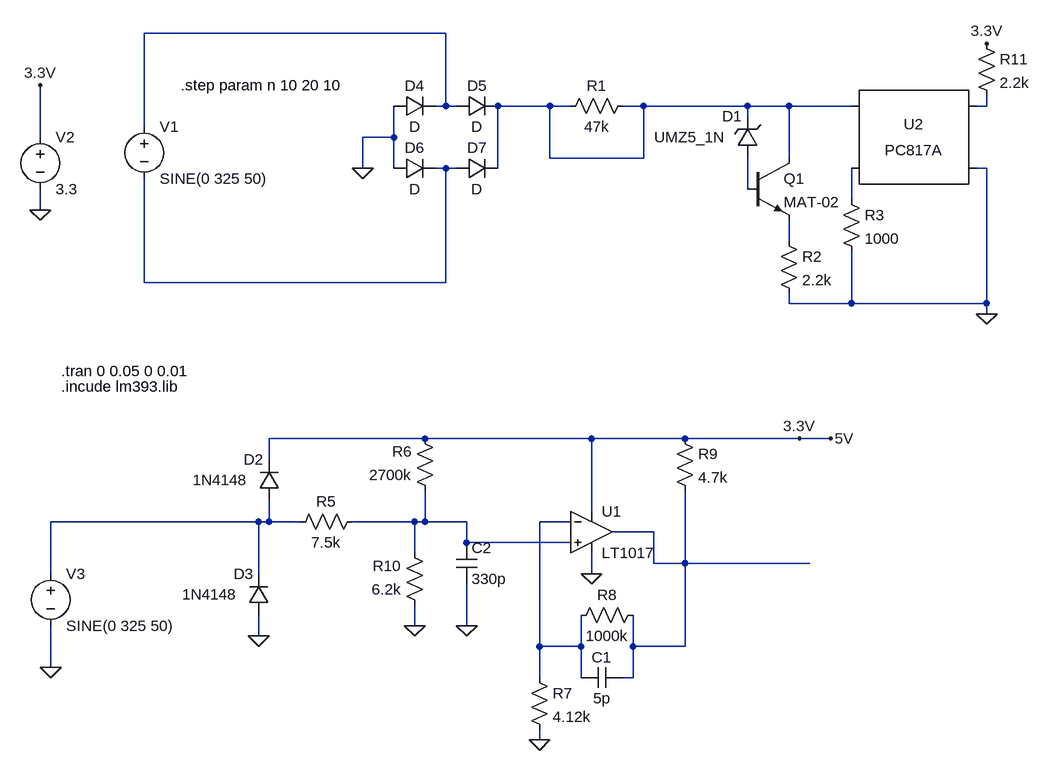
[diagram p0: schematic ZeroComp.asc]
ZeroComp.asc, the LTspice schematic file:
Version 4
SHEET 1 1336 916
WIRE 192 -192 -272 -192
WIRE 192 -80 192 -192
WIRE 192 -80 176 -80
WIRE 208 -80 192 -80
WIRE 352 -80 272 -80
WIRE 384 -80 352 -80
WIRE 496 -80 464 -80
WIRE 656 -80 496 -80
WIRE 720 -80 656 -80
WIRE 816 -80 720 -80
WIRE 1024 -80 1024 -96
WIRE 1024 -80 1008 -80
WIRE 656 -64 656 -80
WIRE -272 -48 -272 -192
WIRE -432 -32 -432 -112
WIRE 112 -32 112 -80
WIRE 112 -32 64 -32
WIRE 352 0 352 -80
WIRE 496 0 496 -80
WIRE 496 0 352 0
WIRE 720 0 720 -80
WIRE 64 16 64 -32
WIRE 112 16 112 -32
WIRE 192 16 176 16
WIRE 208 16 192 16
WIRE 272 16 272 -80
WIRE 1024 16 1008 16
WIRE 656 48 656 0
WIRE 816 64 816 16
WIRE -432 80 -432 48
WIRE 720 128 720 96
WIRE -272 192 -272 32
WIRE 192 192 192 16
WIRE 192 192 -272 192
WIRE 720 224 720 208
WIRE 816 224 816 144
WIRE 816 224 720 224
WIRE 1024 224 1024 16
WIRE 1024 224 816 224
WIRE 1024 240 1024 224
WIRE 160 432 -80 432
WIRE 416 432 160 432
WIRE 560 432 416 432
WIRE 736 432 560 432
WIRE 784 432 736 432
WIRE -80 464 -80 432
WIRE 416 544 416 432
WIRE -96 560 -416 560
WIRE -80 560 -80 528
WIRE -80 560 -96 560
WIRE -32 560 -80 560
WIRE 144 560 48 560
WIRE 160 560 160 512
WIRE 160 560 144 560
WIRE 224 560 160 560
WIRE 384 560 336 560
WIRE 512 576 448 576
WIRE 224 592 224 560
WIRE 384 592 224 592
WIRE 144 608 144 560
WIRE 512 624 512 576
WIRE 560 624 560 512
WIRE 560 624 512 624
WIRE 752 624 560 624
WIRE -416 640 -416 560
WIRE -96 640 -96 560
WIRE 416 640 416 608
WIRE 144 720 144 688
WIRE 224 720 224 656
WIRE -96 736 -96 704
WIRE 336 752 336 560
WIRE 400 752 400 704
WIRE 400 752 336 752
WIRE 480 752 480 704
WIRE 560 752 560 624
WIRE 560 752 480 752
WIRE -416 784 -416 720
WIRE 336 800 336 752
WIRE 400 800 400 752
WIRE 480 800 480 752
WIRE 480 800 464 800
WIRE 336 896 336 880
FLAG -96 736 0
FLAG 144 720 0
FLAG 224 720 0
FLAG 336 896 0
FLAG 784 432 5V
FLAG 1024 -176 3.3V
FLAG 1024 240 0
FLAG -432 80 0
FLAG 64 16 0
FLAG -432 -112 3.3V
FLAG -416 784 0
FLAG 736 432 3.3V
FLAG 416 640 0
SYMBOL voltage -272 -64 R0
WINDOW 123 0 0 Left 0
WINDOW 39 0 0 Left 0
SYMATTR InstName V1
SYMATTR Value SINE(0 325 50)
SYMBOL voltage -432 -48 R0
WINDOW 123 0 0 Left 0
WINDOW 39 0 0 Left 0
SYMATTR InstName V2
SYMATTR Value 3.3
SYMBOL res 64 544 R90
WINDOW 0 0 56 VBottom 2
WINDOW 3 32 56 VTop 2
SYMATTR InstName R5
SYMATTR Value 7.5k
SYMBOL res 176 528 R180
WINDOW 0 36 76 Left 2
WINDOW 3 36 40 Left 2
SYMATTR InstName R6
SYMATTR Value 2700k
SYMBOL res 384 720 R270
WINDOW 0 32 56 VTop 2
WINDOW 3 0 56 VBottom 2
SYMATTR InstName R8
SYMATTR Value 1000k
SYMBOL cap 464 784 R90
WINDOW 0 0 32 VBottom 2
WINDOW 3 32 32 VTop 2
SYMATTR InstName C1
SYMATTR Value 5p
SYMBOL res 544 416 R0
SYMATTR InstName R9
SYMATTR Value 4.7k
SYMBOL diode -64 528 R180
WINDOW 0 24 64 Left 2
WINDOW 3 49 32 Left 2
SYMATTR InstName D2
SYMATTR Value 1N4148
SYMBOL diode -80 704 R180
WINDOW 0 24 64 Left 2
WINDOW 3 49 32 Left 2
SYMATTR InstName D3
SYMATTR Value 1N4148
SYMBOL res 160 704 R180
WINDOW 0 36 76 Left 2
WINDOW 3 36 40 Left 2
SYMATTR InstName R10
SYMATTR Value 6.2k
SYMBOL cap 208 592 R0
SYMATTR InstName C2
SYMATTR Value 330p
SYMBOL res 320 784 R0
SYMATTR InstName R7
SYMATTR Value 4.12k
SYMBOL Comparators\\LT1017 416 576 R0
SYMATTR InstName U1
SYMBOL res 480 -96 R90
WINDOW 0 0 56 VBottom 2
WINDOW 3 32 56 VTop 2
SYMATTR InstName R1
SYMATTR Value 47k
SYMBOL zener 672 0 R180
WINDOW 0 24 64 Left 2
WINDOW 3 49 32 Left 2
SYMATTR InstName D1
SYMATTR Value UMZ5_1N
SYMATTR Description Diode
SYMATTR Type diode
SYMBOL diode 112 -64 R270
WINDOW 0 32 32 VTop 2
WINDOW 3 0 32 VBottom 2
SYMATTR InstName D4
SYMBOL diode 208 -64 R270
WINDOW 0 32 32 VTop 2
WINDOW 3 0 32 VBottom 2
SYMATTR InstName D5
SYMBOL diode 112 32 R270
WINDOW 0 32 32 VTop 2
WINDOW 3 0 32 VBottom 2
SYMATTR InstName D6
SYMBOL diode 208 32 R270
WINDOW 0 32 32 VTop 2
WINDOW 3 0 32 VBottom 2
SYMATTR InstName D7
SYMBOL npn 656 0 R0
SYMATTR InstName Q1
SYMATTR Value MAT-02
SYMBOL res 704 112 R0
SYMATTR InstName R2
SYMATTR Value 2.2k
SYMBOL Optos\\PC817A 912 -32 R0
SYMATTR InstName U2
SYMBOL res 800 48 R0
SYMATTR InstName R3
SYMATTR Value 1000
SYMBOL res 1008 -192 R0
SYMATTR InstName R11
SYMATTR Value 2.2k
SYMBOL voltage -416 624 R0
WINDOW 123 0 0 Left 0
WINDOW 39 0 0 Left 0
SYMATTR InstName V3
SYMATTR Value SINE(0 325 50)
TEXT -400 328 Left 2 !.tran 0 0.05 0 0.01
TEXT -400 352 Left 2 !.incude lm393.lib
TEXT -216 -112 Left 2 !.step param n 10 20 10

The netlist it stands for:
* ZeroComp.asc
V1 N001 N004 SINE(0 325 50)
V2 3.3V 0 3.3
R5 N009 N008 7.5k
R6 N009 3.3V 2700k
R8 N010 N011 1000k
C1 N011 N010 5p
R9 3.3V N011 4.7k
D2 N008 3.3V 1N4148
D3 0 N008 1N4148
R10 0 N009 6.2k
C2 N009 0 330p
R7 N010 0 4.12k
XU1 N009 N010 3.3V 0 N011 LT1017  ; pins In+ In- V+ V- OUT
R1 N002 N002 47k
D1 N005 N002 UMZ5_1N
D4 0 N001 D
D5 N001 N002 D
D6 0 N004 D
D7 N004 N002 D
Q1 N002 N005 N007 0 MAT-02
R2 N007 0 2.2k
XU2 N002 N006 N003 0 PC817 Igain=1m
R3 N006 0 1000
R11 3.3V N003 2.2k
V3 N008 0 SINE(0 325 50)
.model D D
.lib standard.dio
.model NPN NPN
.model PNP PNP
.lib standard.bjt
.tran 0 0.05 0 0.01
.incude lm393.lib
.step param n 10 20 10
.lib PC817.sub
.backanno
.end